# EAGLE schematic custom PCB rev4 (EAGLE 9.2.0)
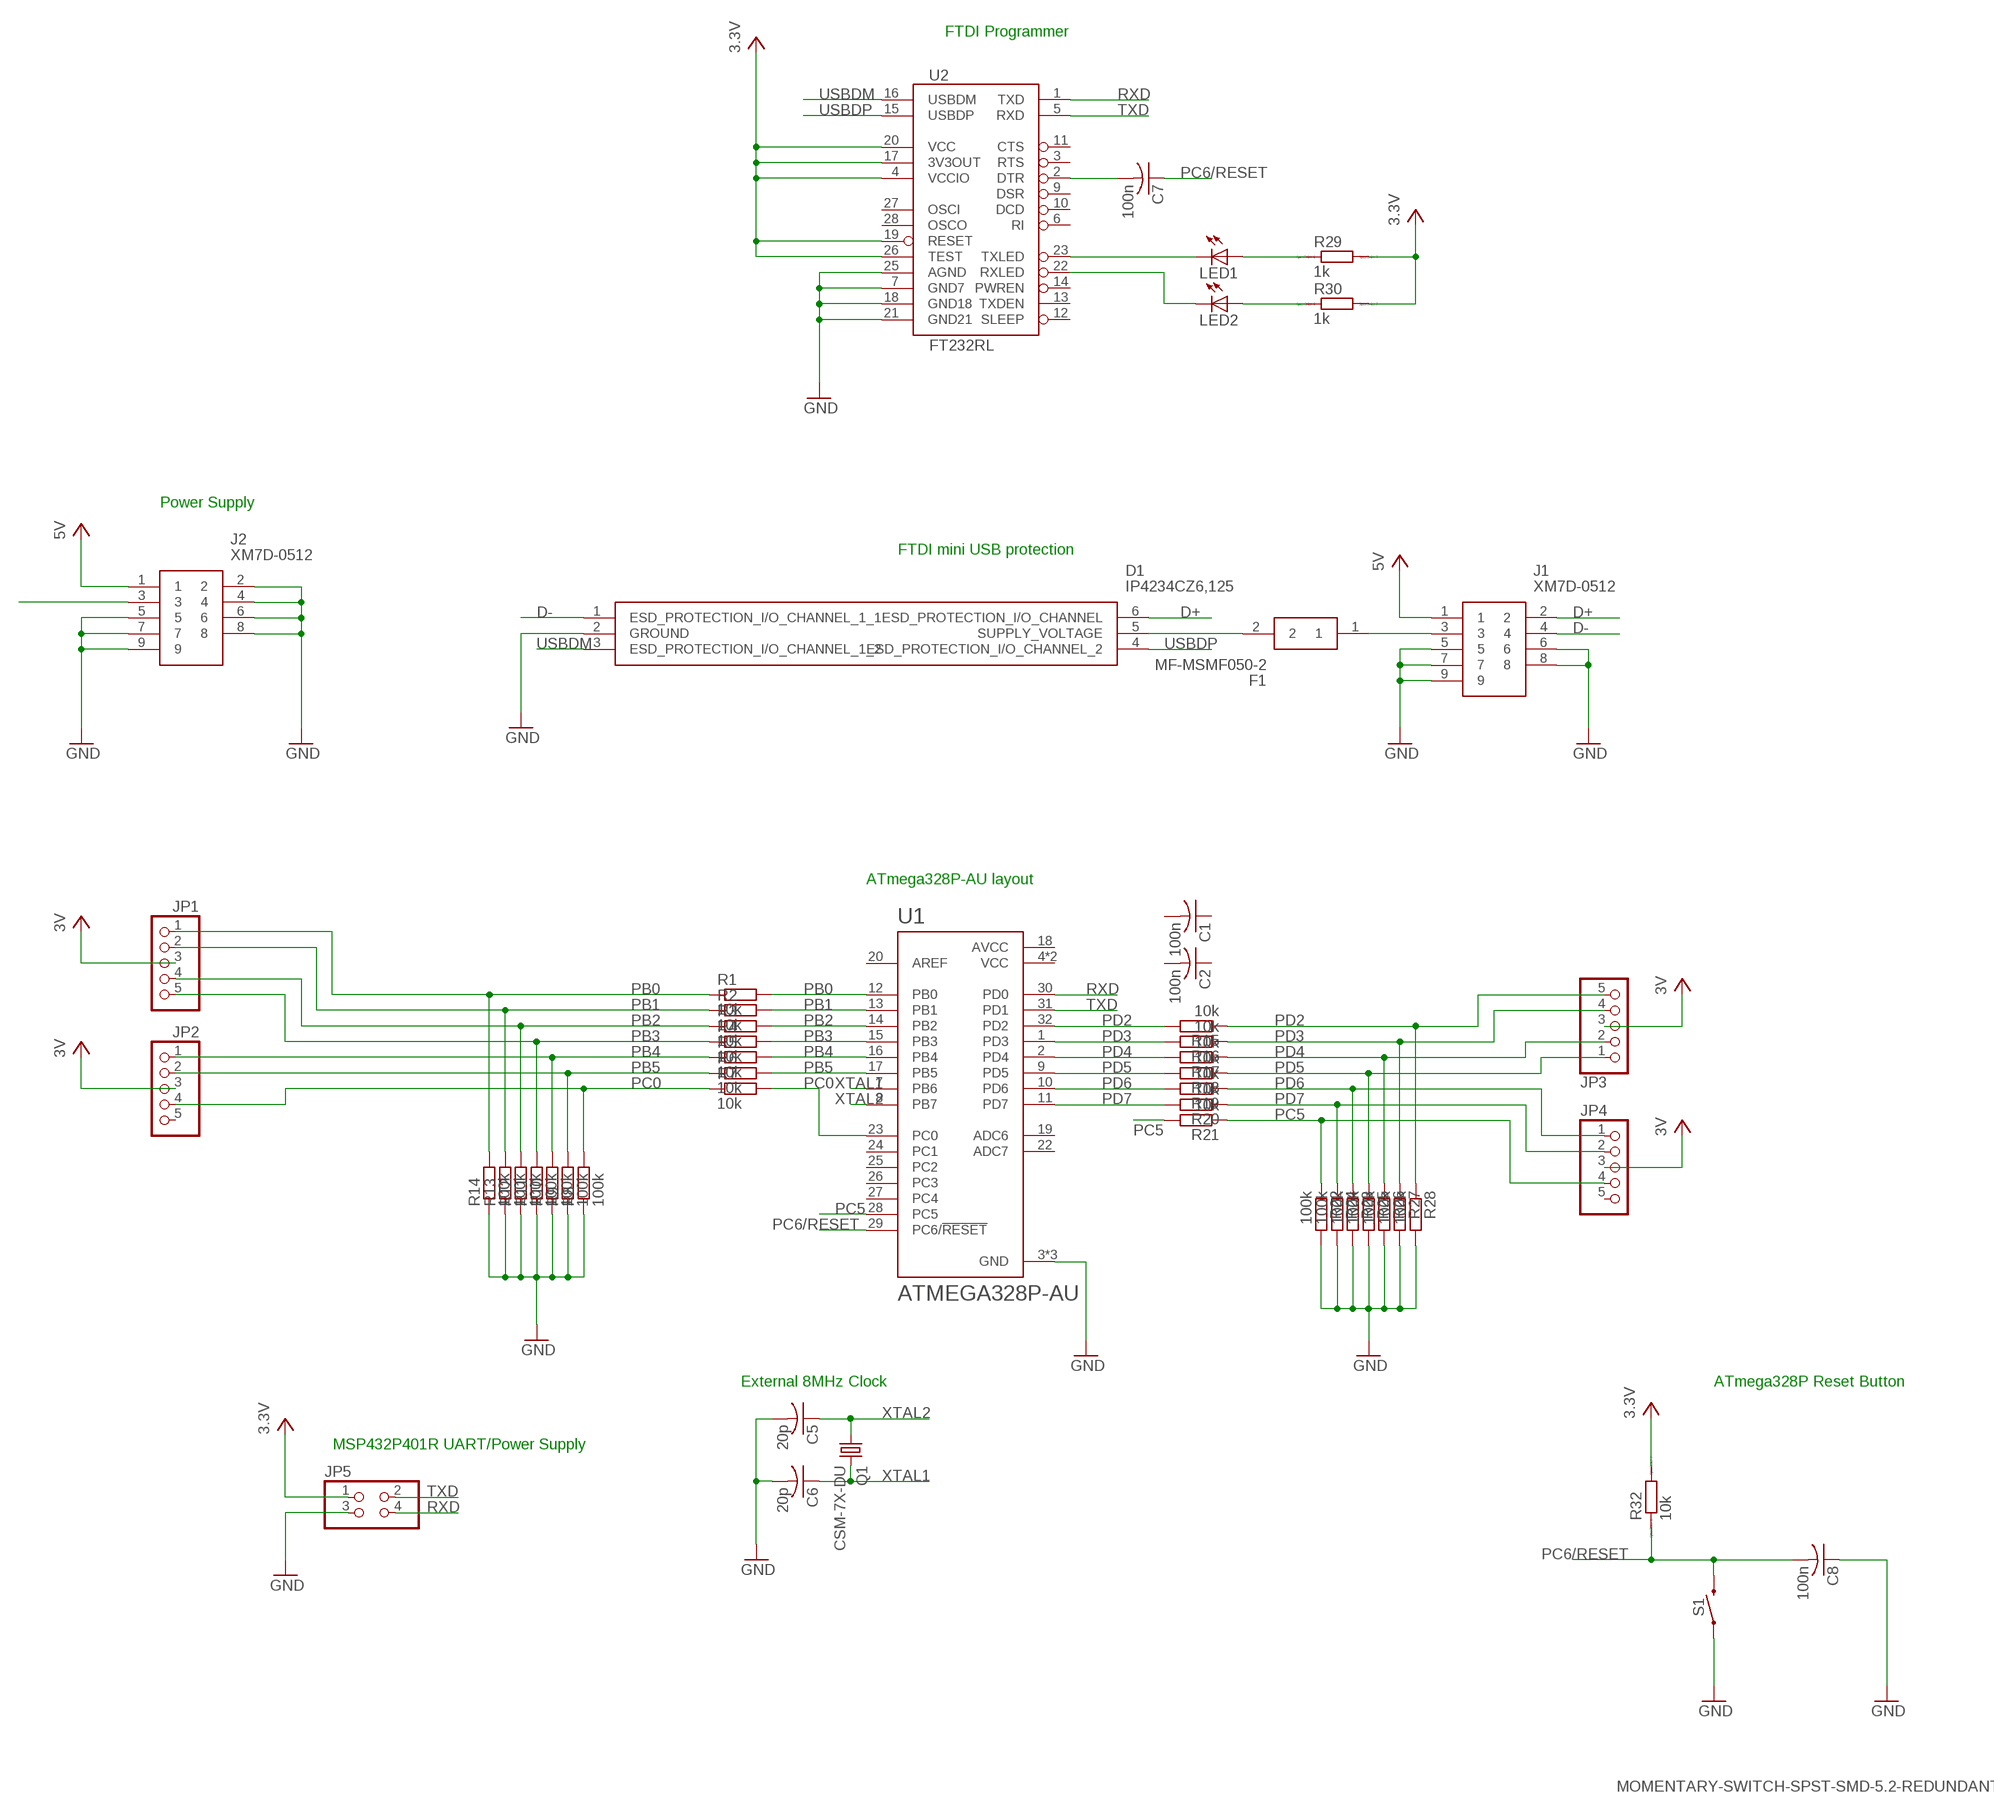
[diagram p0: schematic, sheet 1]

## Parts
C1  100n  C-USC0603  [C0603]
C2  100n  C-USC0603  [C0603]
C5  20p  C-USC0603  [C0603]
C6  20p  C-USC0603  [C0603]
C7  100n  C-USC0603  [C0603]
C8  100n  C-USC0603  [C0603]
D1  IP4234CZ6,125  [SOT95P275X110-6N]
F1  MF-MSMF050-2  [FUSC4632X85N]
J1  XM7D-0512  [XM7D0512]
J2  XM7D-0512  [XM7D0512]
JP1  PINHD-1X5  [1X05]
JP2  PINHD-1X5  [1X05]
JP3  PINHD-1X5  [1X05]
JP4  PINHD-1X5  [1X05]
JP5  PINHD-2X2  [2X02]
LED1  LEDCHIP-LED0603  [CHIP-LED0603]
LED2  LEDCHIP-LED0603  [CHIP-LED0603]
Q1  CSM-7X-DU  [CSM-7X-DU]
R1  10k  R-EU_R0603  [R0603]
R2  10k  R-EU_R0603  [R0603]
R3  10k  R-EU_R0603  [R0603]
R4  10k  R-EU_R0603  [R0603]
R5  10k  R-EU_R0603  [R0603]
R6  10k  R-EU_R0603  [R0603]
R7  10k  R-EU_R0603  [R0603]
R8  100k  R-EU_R0603  [R0603]
R9  100k  R-EU_R0603  [R0603]
R10  100k  R-EU_R0603  [R0603]
R11  100k  R-EU_R0603  [R0603]
R12  100k  R-EU_R0603  [R0603]
R13  100k  R-EU_R0603  [R0603]
R14  100k  R-EU_R0603  [R0603]
R15  10k  R-EU_R0603  [R0603]
R16  10k  R-EU_R0603  [R0603]
R17  10k  R-EU_R0603  [R0603]
R18  10k  R-EU_R0603  [R0603]
R19  10k  R-EU_R0603  [R0603]
R20  10k  R-EU_R0603  [R0603]
R21  10k  R-EU_R0603  [R0603]
R22  100k  R-EU_R0603  [R0603]
R23  100k  R-EU_R0603  [R0603]
R24  100k  R-EU_R0603  [R0603]
R25  100k  R-EU_R0603  [R0603]
R26  100k  R-EU_R0603  [R0603]
R27  100k  R-EU_R0603  [R0603]
R28  100k  R-EU_R0603  [R0603]
R29  1k  RR0402  [R0402]
R30  1k  RR0402  [R0402]
R32  10k  RR0402  [R0402]
S1  MOMENTARY-SWITCH-SPST-SMD-5.2-REDUNDANT  [TACTILE_SWITCH_SMD_5.2MM]
U1  ATMEGA328P-AU  [QFP80P900X900X120-32N]
U2  FT232RL  FT232RLSSOP  [SSOP28DB]

## Nets
D+: D1.6(ESD_PROTECTION_I/O_CHANNEL) J1.2
D-: D1.1(ESD_PROTECTION_I/O_CHANNEL_1_1) J1.4
GND: C5.2 C6.2 C8.1 D1.2(GROUND) J1.5 J1.6 J1.7 J1.8 J1.9 J2.2 J2.4 J2.5 J2.6 J2.7 J2.8 J2.9 JP5.3 R8.1 R9.1 R10.1 R11.1 R12.1 R13.1 R14.1 R22.2 R23.2 R24.2 R25.2 R26.2 R27.2 R28.2 S1.1 S1.2 U1.3(GND) U1.5(GND) U1.21(GND) U2.7(GND7) U2.18(GND18) U2.21(GND21) U2.25(AGND)
N$1: C7.2 U2.2(DTR)
N$2: LED1.C U2.23(TXLED)
N$3: LED2.C U2.22(RXLED)
N$4: D1.5(SUPPLY_VOLTAGE) F1.2
N$5: F1.1 J1.3
N$6: LED1.A R29.1
N$7: LED2.A R30.1
N$9: J2.3
PB0: JP1.1 R1.1 R1.2 R14.2 U1.12(PB0)
PB1: JP1.2 R2.1 R2.2 R13.2 U1.13(PB1)
PB2: JP1.4 R3.1 R3.2 R12.2 U1.14(PB2)
PB3: JP1.5 R4.1 R4.2 R11.2 U1.15(PB3)
PB4: JP2.1 R5.1 R5.2 R10.2 U1.16(PB4)
PB5: JP2.2 R6.1 R6.2 R9.2 U1.17(PB5)
PC0: JP2.4 R7.1 R7.2 R8.2 U1.23(PC0)
PC5: JP4.4 R21.1 R21.2 R22.1 U1.28(PC5)
PC6/RESET: C7.1 C8.2 R32.1 S1.3 S1.4 U1.29(PC6/!RESET)
PD2: JP3.5 R15.1 R15.2 R28.1 U1.32(PD2)
PD3: JP3.4 R16.1 R16.2 R27.1 U1.1(PD3)
PD4: JP3.2 R17.1 R17.2 R26.1 U1.2(PD4)
PD5: JP3.1 R18.1 R18.2 R25.1 U1.9(PD5)
PD6: JP4.1 R19.1 R19.2 R23.1 U1.10(PD6)
PD7: JP4.2 R20.1 R20.2 R24.1 U1.11(PD7)
RXD: JP5.4 U1.30(PD0) U2.1(TXD)
TXD: JP5.2 U1.31(PD1) U2.5(RXD)
USBDM: D1.3(ESD_PROTECTION_I/O_CHANNEL_1_2) U2.16(USBDM)
USBDP: D1.4(ESD_PROTECTION_I/O_CHANNEL_2) U2.15(USBDP)
VCC: J1.1 J2.1 JP1.3 JP2.3 JP3.3 JP4.3 JP5.1 R29.2 R30.2 R32.2 U2.4(VCCIO) U2.17(3V3OUT) U2.19(RESET) U2.20(VCC) U2.26(TEST) ; supply symbol labelled 3.3V, 3V, 5V
XTAL1: C6.1 Q1.2 U1.7(PB6)
XTAL2: C5.1 Q1.1 U1.8(PB7)
Unconnected: C1.1 C1.2 C2.1 C2.2 JP2.5 JP4.5 U1.19(ADC6) U1.20(AREF) U1.22(ADC7) U1.24(PC1) U1.25(PC2) U1.26(PC3) U1.27(PC4) U2.3(RTS) U2.6(RI) U2.9(DSR) U2.10(DCD) U2.11(CTS) U2.12(SLEEP) U2.13(TXDEN) U2.14(PWREN) U2.27(OSCI) U2.28(OSCO)

## Notes on the sheet
- FTDI Programmer
- Power Supply
- FTDI mini USB protection
- ATmega328P-AU layout
- External 8MHz Clock | ATmega328P Reset Button
- MSP432P401R UART/Power Supply

## Power pins joined to a net without a drawn wire
AVCC: U1.18(AVCC)
VCC: U1.4(VCC) U1.6(VCC)

## Library data of the parts
C1 C2 C5-C8 = rcl:C-US: CAPACITOR, American symbol; SPICEPREFIX: C
D1 = SamacSys_Parts:IP4234CZ6,125: TVS DIODE 5.5VWM 6TSOP Source: Datasheet <https://componentsearchengine.com/Datasheets/1/IP4234CZ6,125.pdf>; DESCRIPTION: TVS DIODE 5.5VWM 6TSOP; HEIGHT: 1.1mm; MANUFACTURER_NAME: Nexperia; MANUFACTURER_PART_NUMBER: IP4234CZ6,125; MOUSER_PART_NUMBER: 771-IP4234CZ6125; MOUSER_PRICE-STOCK: https://www.mouser.com/Search/Refine.aspx?Keyword=771-IP4234CZ6125
F1 = SamacSys_Parts:MF-MSMF050-2: Fuse, PTC, Resettable, SMD, 1812, 500mA Bourns 0.5A Surface Mount Resettable Fuse, 15 V Source: Datasheet <https://componentsearchengine.com/Datasheets/1/MF-MSMF050-2.pdf>; DESCRIPTION: Fuse, PTC, Resettable, SMD, 1812, 500mA Bourns 0.5A Surface Mount Resettable Fuse, 15 V; HEIGHT: 0.85mm; MANUFACTURER_NAME: Bourns; MANUFACTURER_PART_NUMBER: MF-MSMF050-2; MOUSER_PART_NUMBER: 652-MF-MSMF050-2; MOUSER_PRICE-STOCK: https://www.mouser.com/Search/Refine.aspx?Keyword=652-MF-MSMF050-2
J1 J2 = SamacSys_Parts:XM7D-0512: OMRON ELECTRONIC COMPONENTS - XM7D-0512 - MINI USB, 2.0 TYPE B, RECEPTACLE, TH Source: Datasheet <https://componentsearchengine.com/Datasheets/1/XM7D-0512.pdf>; DESCRIPTION: OMRON ELECTRONIC COMPONENTS - XM7D-0512 - MINI USB, 2.0 TYPE B, RECEPTACLE, TH; HEIGHT: 3mm; MANUFACTURER_NAME: Omron Electronics; MANUFACTURER_PART_NUMBER: XM7D-0512; MOUSER_PART_NUMBER: 653-XM7D-0512; MOUSER_PRICE-STOCK: https://www.mouser.com/Search/Refine.aspx?Keyword=653-XM7D-0512
JP1-JP4 = pinhead:PINHD-1X5: PIN HEADER
JP5 = pinhead:PINHD-2X2: PIN HEADER
LED1 LED2 = led:LED: LED OSRAM: - CHIPLED LG R971, LG N971, LY N971, LG Q971, LY Q971, LO R971, LY R971 LH N974, LH R974 LS Q976, LO Q976, LY Q976 LO Q996 - Hyper CHIPLED LW Q18S LB Q993, LB Q99A, LB R99A - SideLED LS A670, LO A670, LY A670, LG A670, LP A670 LB A673, LV A673, LT A673, LW A673 LH A674 LY A675 LS A676, LA A676, LO A676, LY A676, LW A676 LS A679, LY A679, LG A679 - Hyper Micro SIDELED® LS Y876, LA Y876, LO Y876, LY Y876 LT Y87S - SmartLED LW L88C, LW L88S LB L89C, LB L89S, LG L890 LS L89K, LO L89K, LY L89K LS L896, LA L896, LO L896, LY L896 - TOPLED LS T670, LO T670, LY T670, LG T670, LP T670 LSG T670, LSP T670, LSY T670, LOP T670, LYG T670 LG T671, LOG T671, LSG T671 LB T673, LV T673, LT T673, LW T673 LH T674 LS T676, LA T676, LO T676, LY T676, LB T676, LH T676, LSB T676, LW T676 LB T67C, LV T67C, LT T67C, LS T67K, LO T67K, LY T67K, LW E67C LS E67B, LA E67B, LO E67B, LY E67B, LB E67C, LV E67C, LT E67C LW T67C LS T679, LY T679, LG T679 LS T770, LO T770, LY T770, LG T770, LP T770 LB T773, LV T773, LT T773, LW T773 LH T774 LS E675, LA E675, LY E675, LS T675 LS T776, LA T776, LO T776, LY T776, LB T776 LHGB T686 LT T68C, LB T68C - Hyper Mini TOPLED® LB M676 - Mini TOPLED Santana® LG M470 LS M47K, LO M47K, LY M47K Source: http://www.osram.convergy.de LUXEON: - LUMILED® LXK2-PW12-R00, LXK2-PW12-S00, LXK2-PW14-U00, LXK2-PW14-V00 LXK2-PM12-R00, LXK2-PM12-S00, LXK2-PM14-U00 LXK2-PE12-Q00, LXK2-PE12-R00, LXK2-PE12-S00, LXK2-PE14-T00, LXK2-PE14-U00 LXK2-PB12-K00, LXK2-PB12-L00, LXK2-PB12-M00, LXK2-PB14-N00, LXK2-PB14-P00, LXK2-PB14-Q00 LXK2-PR12-L00, LXK2-PR12-M00, LXK2-PR14-Q00, LXK2-PR14-R00 LXK2-PD12-Q00, LXK2-PD12-R00, LXK2-PD12-S00 LXK2-PH12-R00, LXK2-PH12-S00 LXK2-PL12-P00, LXK2-PL12-Q00, LXK2-PL12-R00 Source: www.luxeon.com KINGBRIGHT: KA-3528ASYC Source: www.kingbright.com
Q1 = crystal:CSM-7X-DU: SMD CRYSTAL Source: www.ecsxtal.com .. Crystal 3.6864MHz CSM_7X_DU.PDF; OC_FARNELL: unknown; OC_NEWARK: unknown
R1-R28 = rcl:R-EU_: RESISTOR, European symbol; SPICEPREFIX: R
R29 R30 R32 = eagle-ltspice:R: RESISTOR, European symbol; SPICEMODEL: NONE; SPICEPREFIX: R
S1 = SparkFun-Switches:MOMENTARY-SWITCH-SPST: Momentary Switch (Pushbutton) - SPST Normally-open (NO) SPST momentary switches (buttons, pushbuttons). Variants PTH-12MM - 12mm square, through-hole Momentary Pushbutton Switch - 12mm Square <https://www.sparkfun.com/products/9190> (COM-09190) PTH-6.0MM, PTH-6.0MM-KIT - 6.0mm square, through-hole Mini Pushbutton Switch <https://www.sparkfun.com/products/97> (COM-00097) KIT package intended for soldering kit's - only one side of pads' copper is exposed. PTH-RIGHT-ANGLE-KIT - Right-angle, through-hole Right Angle Tactile Button <https://www.sparkfun.com/products/10791> - Used on SparkFun BigTime Watch Kit <https://www.sparkfun.com/products/11734> SMD-12MM - 12mm square, surface-mount Tactile Button - SMD (12mm) <https://www.sparkfun.com/products/12993> (COM-12993) Used on SparkFun PicoBoard <https://www.sparkfun.com/products/11888> SMD-4.5MM - 4.5mm Square Trackball Switch Used on SparkFun Blackberry Trackballer Breakout <https://www.sparkfun.com/products/13169> SMD-4.6MMX2.8MM - 4.60mm x 2.80mm, surface mount Used on SparkFun SAMD21 Mini Breakout <https://www.sparkfun.com/products/13664> SMD-5.2MM, SMD-5.2-REDUNDANT - 5.2mm square, surface-mount Mini Pushbutton Switch - SMD <https://www.sparkfun.com/products/8720> (COM-08720) Used on Arduino Pro Mini <https://www.sparkfun.com/products/11114> REDUNDANT package connects both switch circuits together SMD-6.0X3.5MM - 6.0 x 3.5mm, surface mount Momentary Reset Switch SMD <https://www.sparkfun.com/products/8229> (COM-08229) SMD-6.2MM-TALL - 6.2mm square, surface mount Tactile Button - SMD (6mm) <https://www.sparkfun.com/products/12992> Used on SparkFun Digital Sandbox <https://www.sparkfun.com/products/12651> SMD-RIGHT-ANGLE - Right-angle, surface mount Used on SparkFun Block for Intel® Edison - Arduino <https://www.sparkfun.com/products/13036>; PROD_ID: SWCH-08247; SF_SKU: COM-08720
U1 = ATMEGA328P-AU:ATMEGA328P-AU: ATmega Series 20 MHz 32 KB Flash 2 KB SRAM 8-Bit Microcontroller - TQFP-32; DESCRIPTION: Microcontroller Mcu, 8 Bit, Atmega, 20mhz, Tqfp-32; DIGI-KEY_PART_NUMBER: ATMEGA328P-AU-ND; DIGI-KEY_PURCHASE_URL: https://www.digikey.com/product-detail/en/microchip-technology/ATMEGA328P-AU/ATMEGA328P-AU-ND/1832260?utm_source=snapeda&utm_medium=aggregator&utm_campaign=symbol; MF: Microchip; MP: ATMEGA328P-AU; PACKAGE: TQFP-32 Microchip
U2 = SparkFun-IC-Comms:FT232RL: FT232RL USB UART FT232RL 4th Generation USB UART (USB <-> Serial) Controller. Datasheet <http://www.sparkfun.com/datasheets/IC/FT232R_v104.pdf> SparkFun Products Component <https://www.sparkfun.com/products/650> (COM-00650) SparkFun RedBot Mainboard <https://www.sparkfun.com/products/12097> (ROB-12097) SparkFun FTDI Basic Breakout - 5V <https://www.sparkfun.com/products/9716> (DEV-09716) SparkFun FTDI Basic Breakout - 3.3V <https://www.sparkfun.com/products/9873> (DEV-09873) Bus Pirate - v3.6a <https://www.sparkfun.com/products/12942> (TOL-12942) SparkFun USB to Serial Breakout - FT232RL <https://www.sparkfun.com/products/12731> (BOB-12731) SparkFun PicoBoard <https://www.sparkfun.com/products/11888> (WIG-11888) SparkFun RFID USB Reader <https://www.sparkfun.com/products/9963> (SEN-09963) LilyPad FTDI Basic Breakout - 5V <https://www.sparkfun.com/products/10275> (DEV-10275) SparkFun Stepoko <https://www.sparkfun.com/products/13899> (ROB-13899); PROD_ID: IC-00870